# EAGLE design main (EAGLE 9.6.2)
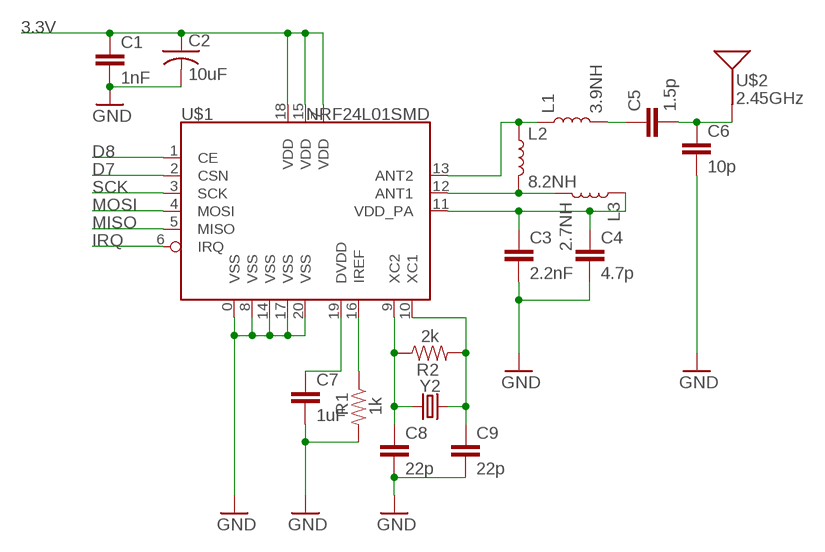
[diagram p0: schematic, sheet 1]

## Parts
C1  1nF  CAP0805  [0805]
C2  10uF  C-USC1206  [C1206]
C3  2.2nF  CAP0805  [0805]
C4  4.7p  CAP0805  [0805]
C5  1.5p  CAP0805  [0805]
C6  10p  CAP0805  [0805]
C7  1uF  CAP0805  [0805]
C8  22p  CAP0805  [0805]
C9  22p  CAP0805  [0805]
L1  3.9NH  INDUCTOR-0402-3.9NH  [0402]
L2  8.2NH  INDUCTOR-0402-3.9NH  [0402]
L3  2.7NH  INDUCTOR-0402-3.9NH  [0402]
R1  1k  RESISTOR0805-RES  [0805]
R2  2k  RESISTOR0805-RES  [0805]
U$1  NRF24L01SMD  [QFN20-4X4MM]
U$2  2.45GHz  ANTENNA2.4GHZ-6.5X2.2MM  [ANT-2.4GHZ-6.5X2.2MM]
Y2  CRYSTALSMD-5X3.2-4PAD  [CRYSTAL-SMD-5X3.2-4PAD]

## Nets
3.3V: C1.1 C2.1 U$1.7(VDD) U$1.15(VDD) U$1.18(VDD)
D7: U$1.2(CSN)
D8: U$1.1(CE)
GND: C1.2 C2.2 C3.2 C4.2 C6.2 C7.2 C8.2 C9.2 R1.2 U$1.0(VSS) U$1.8(VSS) U$1.14(VSS) U$1.17(VSS) U$1.20(VSS)
IRQ: U$1.6(IRQ)
MISO: U$1.5(MISO)
MOSI: U$1.4(MOSI)
N$4: C5.1 L1.2
N$14: L1.1 L2.1 U$1.13(ANT2)
N$15: L2.2 L3.2 U$1.12(ANT1)
N$16: C3.1 C4.1 L3.1 U$1.11(VDD_PA)
N$17: C7.1 U$1.19(DVDD)
N$18: R1.1 U$1.16(IREF)
N$19: C5.2 C6.1 U$2.FEED(SIGNAL)
N$20: C8.1 R2.1 U$1.9(XC2) Y2.1
N$21: C9.1 R2.2 U$1.10(XC1) Y2.3
SCK: U$1.3(SCK)

## Library data of the parts
C1 C3-C9 = SparkFun-Passives:CAP: Capacitor Standard 0603 ceramic capacitor, and 0.1" leaded capacitor.
C2 = adafruit:C-US: CAPACITOR, American symbol
L1 = SparkFun-Coils:INDUCTOR: Inductors Resist changes in electrical current. Basically a coil of wire. SparkFun Products: SparkFun Load Cell Amplifier - HX711 <https://www.sparkfun.com/products/13879> IOIO-OTG - V2.2 <https://www.sparkfun.com/products/13613>; PROD_ID: NDUC-13457
L2 L3 = SparkFun-Coils:INDUCTOR: Inductors Resist changes in electrical current. Basically a coil of wire. SparkFun Products: SparkFun Load Cell Amplifier - HX711 <https://www.sparkfun.com/products/13879> IOIO-OTG - V2.2 <https://www.sparkfun.com/products/13613>; PROD_ID: NDUC-13457; VALUE: 3.9NH
R1 R2 = SparkFun-Resistors:RESISTOR: Resistor Basic schematic elements and footprints for 0603, 1206, and PTH resistors.
U$1 = SparkFun-RF:NRF24L01: Nordic nrf24L01 2.4GHz Low-power Transceiver This is the very popular, low cost, very low power RF transceiver from Nordic Semiconductor. Simple SPI interface. SparkFun Products 2.4GHz Transceiver IC - nRF24L01+ <https://www.sparkfun.com/products/690> (COM-00690) SparkFun Transceiver Breakout - nRF24L01+ (RP-SMA) <https://www.sparkfun.com/products/705> (WRL-00705) SparkFun Transceiver Breakout - nRF24L01+ <https://www.sparkfun.com/products/691> (COM-00691); PROD_ID: IC-08950; SF_ID: COM-00690
U$2 = SparkFun-RF:ANTENNA: Single-ended Antennae 2.4GHz and antennae with just one terminal. These are all chip antennae. 2.4GHz (WiFi/BT/ZigBee) Antennae ANT-2.4GHZ-6.5X2.2MM - 6.5 x 2.2 mm chip antenna. (SparkFun Product <https://www.sparkfun.com/products/144>) ANT-2.4GHZ8.0X1.0MM - 8.0 x 1.0 mm chip antenna. (Datasheet <http://www.mouser.com/ds/2/611/antenna_2500at44m0400-242425.pdf>) ANT-2.4GHZ9.5X2.0MM - 9.5 x 2.0 mm chip antenna. (SparkFun Product <https://www.sparkfun.com/products/9025>); PROD_ID: ANT-08187; SF_ID: WRL-00144
Y2 = SparkFun-Clocks:CRYSTAL: Crystals (Generic) These are passive quartz crystals, which can be used as a clock source for a microcontroller. Crystal's are two-terminal devices. They require external "load" capacitors to generate an oscillating signal.

## Board
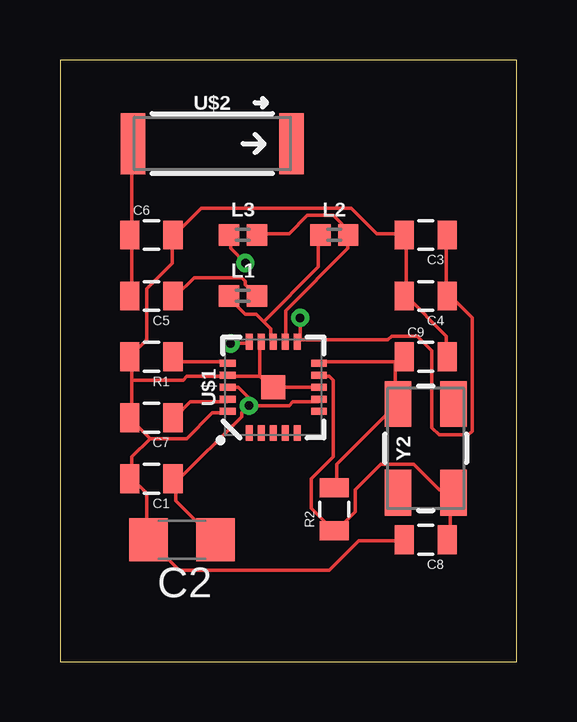
[diagram p1: board, top side]
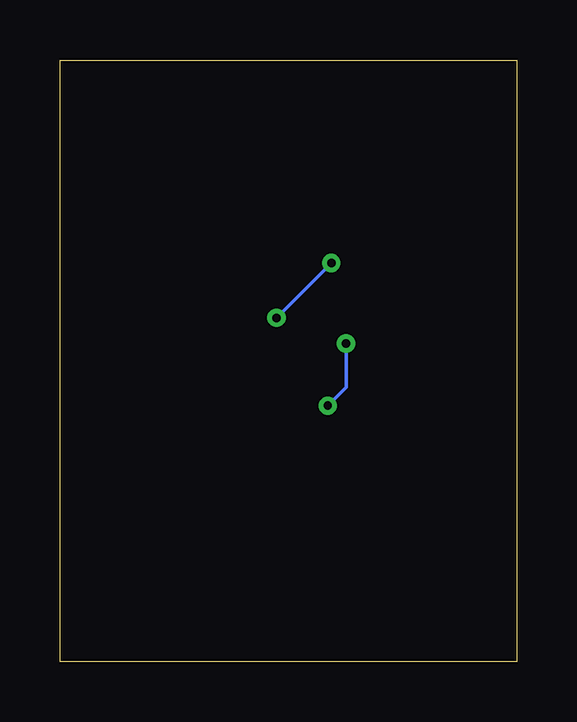
[diagram p2: board, bottom side, seen from below]

Size 19.03 x 25.07 mm. Coordinates in mm from the lower left corner, seen from the top.
Outline: 0,0 19.03,0 19.03,25.07 0,25.07 0,0
Copper layers (1*16): Top 0.035mm / dielectric 1.5mm / Bottom 0.035mm
Design rules "default": minimum track width 6mil, minimum drill 0.35mm, track to track 6mil, track to pad 6mil, pad to pad 6mil, via to via 6mil, smd to smd 6mil, copper to edge 40mil, drill to drill 6mil, minimum pad ring 10mil, minimum via ring 8mil, stop-mask expansion 4mil, vias tented up to drill 0mil, thermal gap 10mil

### Footprints (pad centres in the part's own frame; a part is rotated, then mirrored left to right if it is on the bottom)
0805 = smd 0.8 x 1.2: 1 -0.9,0; 2 0.9,0
C1206 = smd 1.6 x 1.8: 1 -1.4,0; 2 1.4,0
0402 = smd 0.85 x 0.9: 1 -0.58,0; 2 0.58,0
QFN20-4X4MM = smd 1 x 1: 0 0,0 | smd 0.65 x 0.3: 1 -1.9,1; 2 -1.9,0.5; 3 -1.9,0; 4 -1.9,-0.5; 5 -1.9,-1; 11 1.9,-1; 12 1.9,-0.5; 13 1.9,0; 14 1.9,0.5; 15 1.9,1 | smd 0.3 x 0.65: 6 -1,-1.9; 7 -0.5,-1.9; 8 0,-1.9; 9 0.5,-1.9; 10 1,-1.9; 16 1,1.9; 17 0.5,1.9; 18 0,1.9; 19 -0.5,1.9; 20 -1,1.9
ANT-2.4GHZ-6.5X2.2MM = smd 1.016 x 2.54: FEED -3.302,0; NC 3.302,0
CRYSTAL-SMD-5X3.2-4PAD = smd 1.9 x 1.1: 1 -1.85,-1.15; 2 1.85,-1.15; 3 1.85,1.15; 4 -1.85,1.15

### Placement (x,y rotation side)
C1  3.81,7.62 180 top
C2  5.08,5.08 180 top
C3  15.24,17.78 180 top
C4  15.24,15.24 180 top
C5  3.81,15.24 180 top
C6  3.81,17.78 0 top
C7  3.81,10.16 180 top
C8  15.24,5.08 180 top
C9  15.24,12.7 0 top
L1  7.62,15.24 0 top
L2  11.43,17.78 0 top
L3  7.62,17.78 0 top
R1  3.81,12.7 180 top
R2  11.43,6.35 90 top
U$1  8.89,11.43 90 top
U$2  6.35,21.59 0 top
Y2  15.24,8.89 90 top

### Tracks (layer width: path | path; a pad name or v marks a point on that pad's centre or on a via)
3.3V  (via drill 0.35)
  Top 0.152: 8.03,10.82 7.42,11.43 U$1.18 | 8.03,10.82 8.18,10.67 9.55,10.67 9.7,10.82 10.77,10.82 U$1.7 | v7.11,13.26 7.87,13.26 U$1.15 | 8.03,10.82 v7.87,10.67 7.57,10.36 7.57,10.21 4.83,7.47 | 4.83,7.47 4.83,6.71 6.35,5.18 C2.1 | 4.83,7.47 4.83,7.62 C1.1 4.83,7.47
  Bottom 0.152: v7.11,13.26 7.11,11.43 v7.87,10.67
GND
  Top 0.152: C8.2 14.28,5.03 12.45,5.03 11.23,3.81 4.98,3.81 3.76,5.03 C2.2 3.61,5.18 3.61,7.01 3,7.62 | 14.43,15.24 14.43,17.68 C3.2 14.28,17.83 13.21,17.83 12.14,18.9 5.89,18.9 4.83,17.83 C6.2 4.67,17.68 4.67,16.61 3.61,15.54 3.61,13.41 3,12.8 R1.2 3,12.65 3,11.73 | 14.43,15.24 16.1,13.56 16.1,12.8 C9.2 | 14.43,15.24 C4.2 | 8.33,11.89 7.11,11.89 U$1.17 6.96,11.89 5.28,11.89 5.13,11.73 3,11.73 | 8.33,11.89 8.79,11.43 U$1.0 U$1.8 | 8.33,11.89 8.33,13.26 U$1.14 | 3.76,9.3 5.28,9.3 6.35,10.36 6.96,10.36 U$1.20 | 3.76,9.3 3,10.06 C7.2 3,10.21 3,11.73 | 3,7.62 3,8.53 3.76,9.3 | 3,7.62 C1.2
N$4
  Top 0.152: L1.2 8.18,15.24 7.72,15.7 7.72,15.85 7.57,16 5.59,16 4.83,15.24 C5.1
N$14
  Top 0.152: 8.48,14.17 8.18,14.48 7.72,14.48 6.96,15.24 L1.1 | 8.48,14.17 8.79,13.87 8.79,13.41 U$1.13 | 8.48,14.17 10.77,16.46 10.77,17.68 L2.1
N$15
  Top 0.152: U$1.12 9.4,13.41 9.4,14.63 11.99,17.22 11.99,17.68 L2.2 12.14,17.83 11.38,18.59 10.31,18.59 9.55,17.83 8.33,17.83 L3.2
N$16  (via drill 0.35)
  Top 0.152: 10.01,13.41 13.66,13.41 13.82,13.56 14.88,13.56 15.49,12.95 15.49,9.75 15.8,9.45 17.02,9.45 17.17,9.6 17.17,14.33 16.26,15.24 C4.1 16.1,15.24 16.1,17.68 C3.1 | v7.72,16.61 7.11,17.22 7.11,17.68 L3.1 | 10.01,13.41 v10.01,14.33 | 10.01,13.41 U$1.11
  Bottom 0.152: v10.01,14.33 v7.72,16.61
N$17
  Top 0.152: U$1.19 6.96,10.82 5.44,10.82 4.83,10.21 C7.1
N$18
  Top 0.152: U$1.16 6.96,12.5 4.98,12.5 4.83,12.65 R1.1
N$19
  Top 0.152: C5.2 3,15.24 3,17.68 C6.1 3,17.83 3,21.49 U$2.FEED
N$20
  Top 0.152: C8.1 16.26,5.18 16.26,7.01 Y2.1 16.26,7.16 15.8,7.16 14.73,8.23 13.36,8.23 12.29,7.16 12.29,6.25 11.53,5.49 R2.1 11.38,5.49 10.46,6.4 10.46,7.62 11.38,8.53 11.38,11.73 11.23,11.89 10.92,11.89 U$1.9
N$21
  Top 0.152: 13.97,12.5 14.12,12.5 14.28,12.65 C9.1 13.97,12.5 | 13.97,12.5 10.92,12.5 U$1.10 | R2.2 11.53,7.32 11.53,8.23 13.97,10.67 Y2.3 13.97,10.82 13.97,12.5